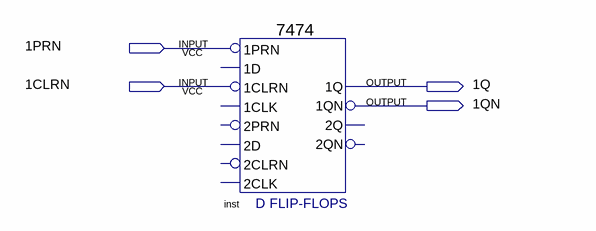
[diagram p0: schematic sheet]
// Quartus schematic exp3_2_1.bdf as structural Verilog: 1 symbols, 4 pins
module exp3_2_1 (
  input  \1PRN ,
  input  \1CLRN ,
  output \1Q ,
  output \1QN 
);

  \7474  inst (
    .\1PRN (\1PRN ), .\1CLRN (\1CLRN ), .\1QN (\1QN ), .\1Q (\1Q ));  // open: 2D, 2PRN, 1CLK, 1D, 2CLK, 2CLRN, 2Q, 2QN
endmodule
